# EAGLE design RS9110-N-11-22 Breakout (EAGLE 6.6.0)
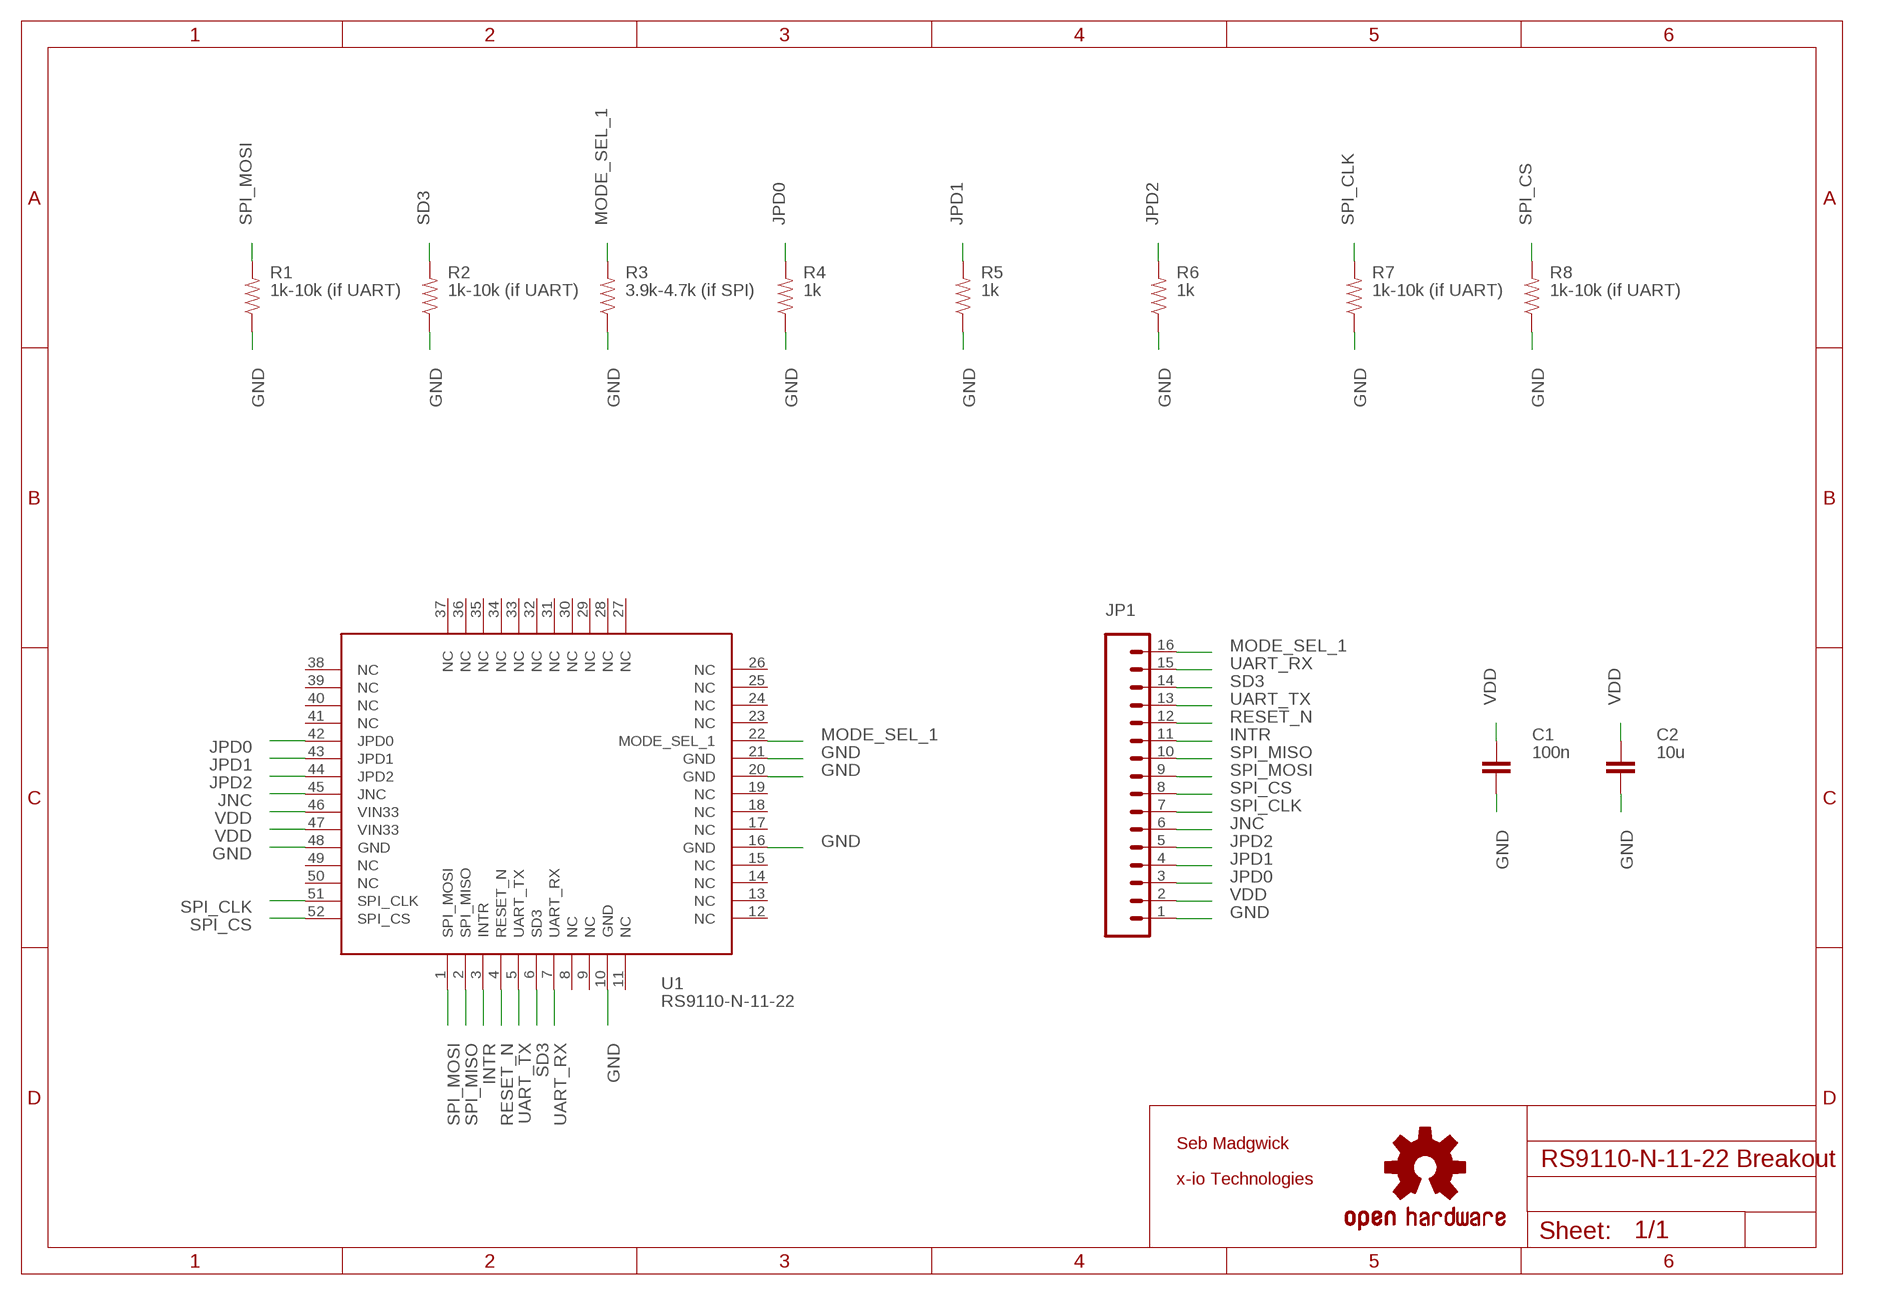
[diagram p0: schematic, sheet 1]

## Parts
C1  100n  CAP0603-CAP  [0603-CAP]
C2  10u  CAP0603-CAP  [0603-CAP]
JP1  M16PTH  [1X16]
LOGO1  OSHW-LOGOS  [OSHW-LOGO-S]
R1  1k-10k (if UART)  RESISTOR0603  [0603-RES]
R2  1k-10k (if UART)  RESISTOR0603  [0603-RES]
R3  3.9k-4.7k (if SPI)  RESISTOR0603  [0603-RES]
R4  1k  RESISTOR0603  [0603-RES]
R5  1k  RESISTOR0603  [0603-RES]
R6  1k  RESISTOR0603  [0603-RES]
R7  1k-10k (if UART)  RESISTOR0603  [0603-RES]
R8  1k-10k (if UART)  RESISTOR0603  [0603-RES]
U1  RS9110-N-11-22  [RS9110-N-11-22]

## Nets
GND: C1.2 C2.2 JP1.1 R1.1 R2.1 R3.1 R4.1 R5.1 R6.1 R7.1 R8.1 U1.10(GND) U1.16(GND) U1.20(GND) U1.21(GND) U1.48(GND)
INTR: JP1.11 U1.3(INTR)
JNC: JP1.6 U1.45(JNC)
JPD0: JP1.3 R4.2 U1.42(JPD0)
JPD1: JP1.4 R5.2 U1.43(JPD1)
JPD2: JP1.5 R6.2 U1.44(JPD2)
MODE_SEL_1: JP1.16 R3.2 U1.22(MODE_SEL_1)
RESET_N: JP1.12 U1.4(RESET_N)
SD3: JP1.14 R2.2 U1.6(SD3)
SPI_CLK: JP1.7 R7.2 U1.51(SPI_CLK)
SPI_CS: JP1.8 R8.2 U1.52(SPI_CS)
SPI_MISO: JP1.10 U1.2(SPI_MISO)
SPI_MOSI: JP1.9 R1.2 U1.1(SPI_MOSI)
UART_RX: JP1.15 U1.7(UART_RX)
UART_TX: JP1.13 U1.5(UART_TX)
VDD: C1.1 C2.1 JP1.2 U1.46(VIN33) U1.47(VIN33)
Unconnected: U1.8(NC) U1.9(NC) U1.11(NC) U1.12(NC) U1.13(NC) U1.14(NC) U1.15(NC) U1.17(NC) U1.18(NC) U1.19(NC) U1.23(NC) U1.24(NC) U1.25(NC) U1.26(NC) U1.27(NC) U1.28(NC) U1.29(NC) U1.30(NC) U1.31(NC) U1.32(NC) U1.33(NC) U1.34(NC) U1.35(NC) U1.36(NC) U1.37(NC) U1.38(NC) U1.39(NC) U1.40(NC) U1.41(NC) U1.49(NC) U1.50(NC)

## Notes on the sheet
- Seb Madgwick
- x-io Technologies

## Library data of the parts
C1 C2 = SparkFun-Capacitors:CAP: Capacitor Standard 0603 ceramic capacitor, and 0.1" leaded capacitor.
JP1 = SparkFun-Connectors:M16: 1x16 .1" header
LOGO1 = SparkFun-Aesthetics:OSHW-LOGO: Open Source Hardware Logo This logo indicates the piece of hardware it is found on incorporates a OSHW license and/or adheres to the definition of open source hardware found here: http://freedomdefined.org/OSHW
R1-R8 = SparkFun-Resistors:RESISTOR: Resistor Basic schematic elements and footprints for 0603, 1206, and PTH resistors.
U1 = x-io:RS9110-N-11-22

## Board
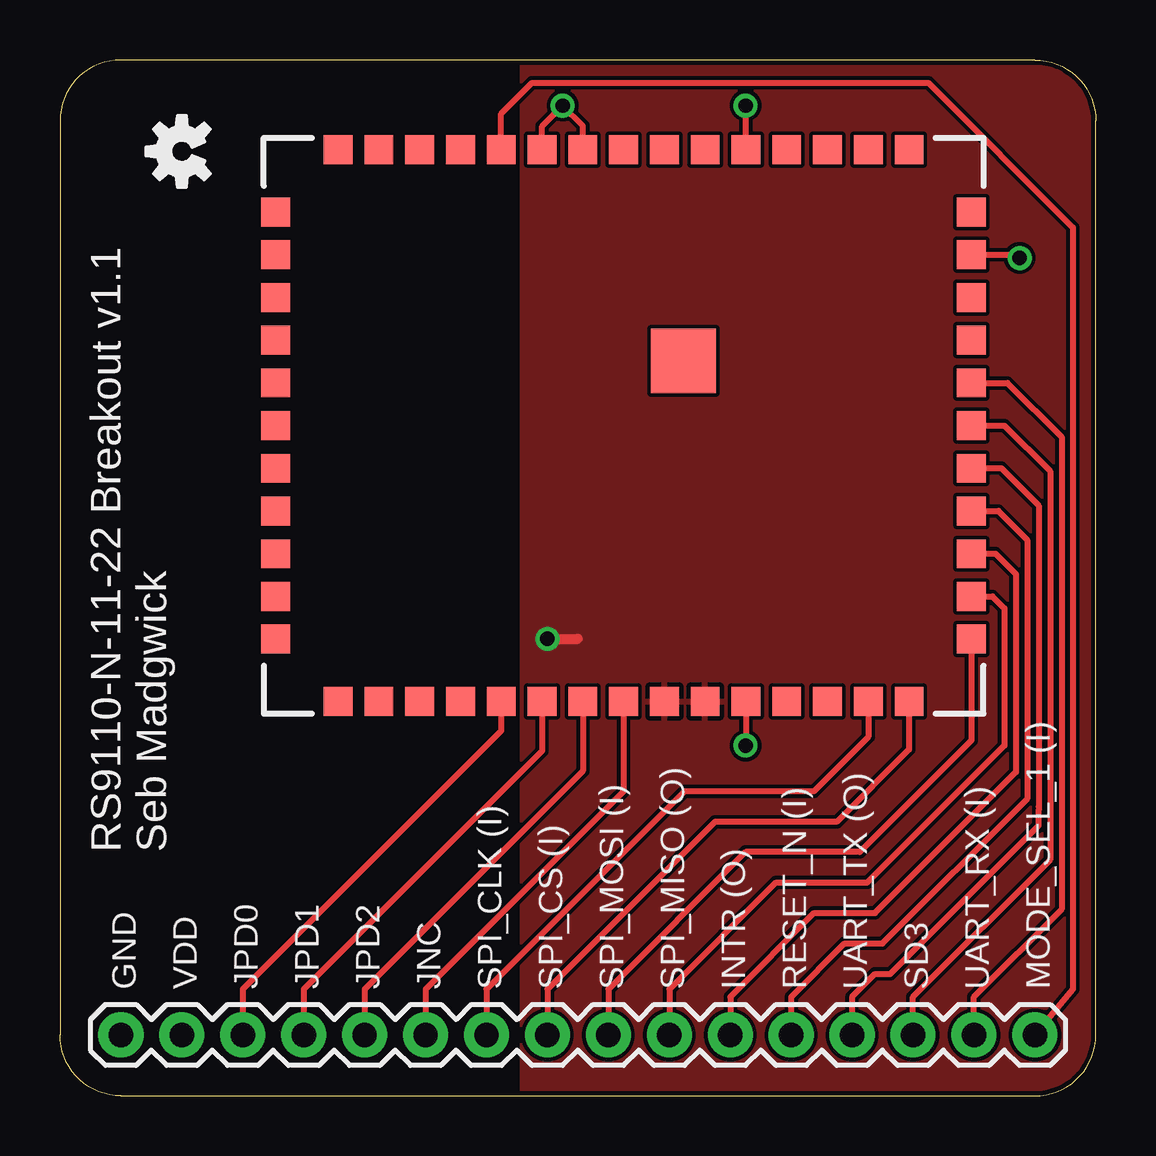
[diagram p1: board, top side]
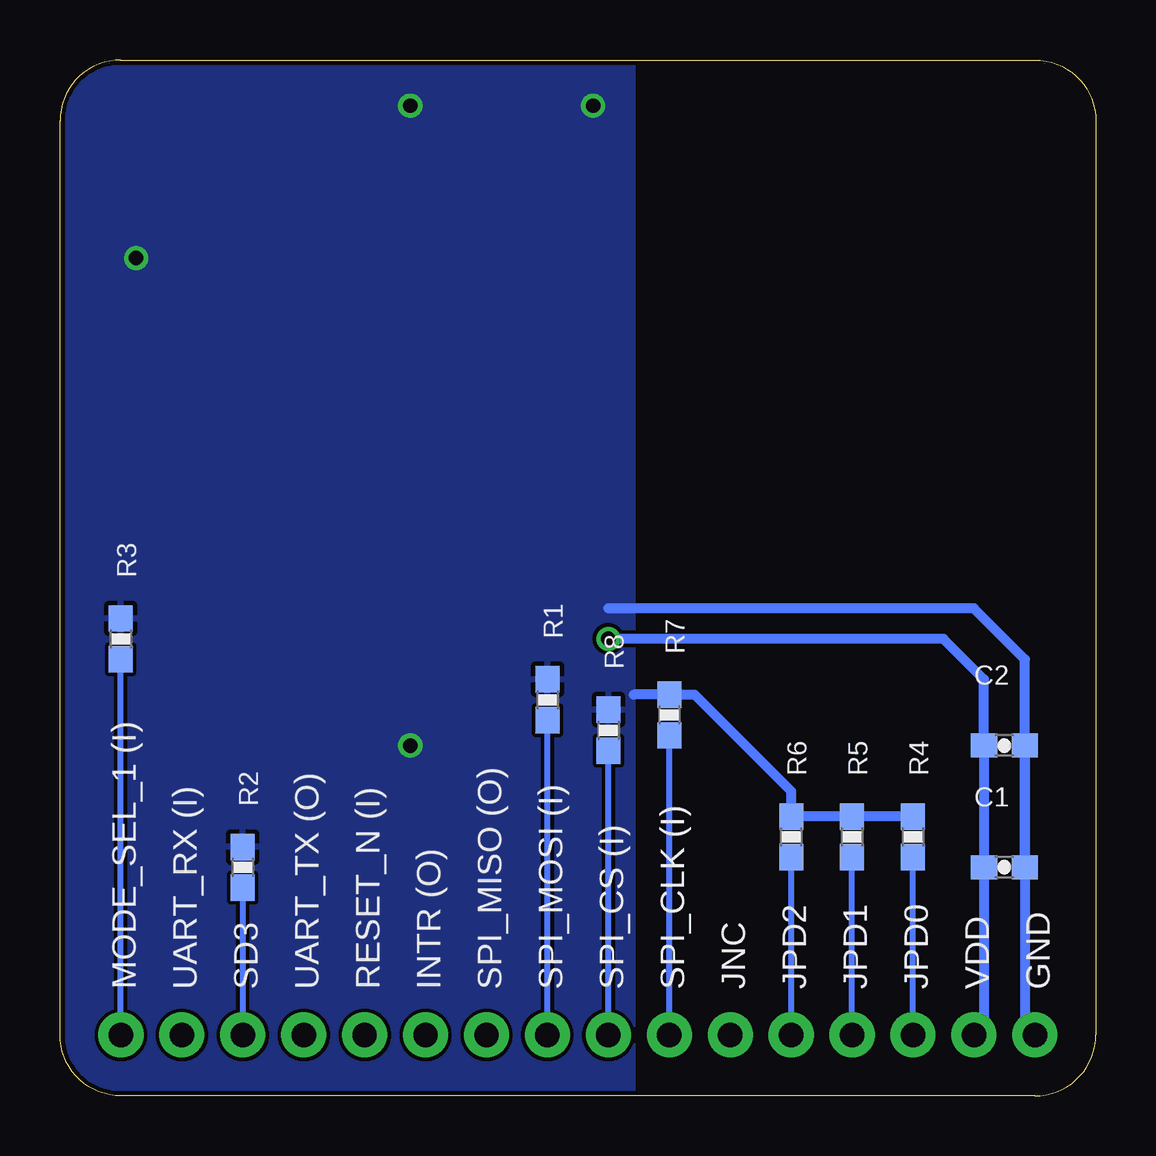
[diagram p2: board, bottom side, seen from below]

Size 43.18 x 43.18 mm. Coordinates in mm from the lower left corner, seen from the top.
Outline: 2.54,0 40.64,0 arc90 43.18,2.54 43.18,40.64 arc90 40.64,43.18 2.54,43.18 arc90 0,40.64 0,2.54 arc90 2.54,0
Copper layers (1*16): Top 0.035mm / dielectric 1.5mm / Bottom 0.035mm
Design rules "default *": minimum track width 6mil, minimum drill 13mil, track to track 6mil, track to pad 6mil, pad to pad 6mil, via to via 6mil, smd to smd 0.15mm, copper to edge 0.2mm, drill to drill 0.15mm, minimum pad ring 10mil, minimum via ring 8mil, stop-mask expansion 4mil, vias tented up to drill 1mm, thermal gap 0.195mm
tRestrict: area 0,0 to 19.1,43.2
bRestrict: area 0,0 to 19.1,43.2

### Footprints (pad centres in the part's own frame; a part is rotated, then mirrored left to right if it is on the bottom)
0603-CAP = smd 1.1 x 1: 1 -0.85,0; 2 0.85,0
1X16 = drill 1.016 pad 1.88: 1 0,0; 2 2.54,0; 3 5.08,0; 4 7.62,0; 5 10.16,0; 6 12.7,0; 7 15.24,0; 8 17.78,0; 9 20.32,0; 10 22.86,0; 11 25.4,0; 12 27.94,0; 13 30.48,0; 14 33.02,0; 15 35.56,0; 16 38.1,0
0603-RES = smd 1.1 x 1: 1 -0.85,0; 2 0.85,0
RS9110-N-11-22 = smd 1.2 x 1.2: 1 -8.9,-14.5; 2 -7.12,-14.5; 3 -5.34,-14.5; 4 -3.56,-14.5; 5 -1.78,-14.5; 6 0,-14.5; 7 1.78,-14.5; 8 3.56,-14.5; 9 5.34,-14.5; 10 7.12,-14.5; 11 8.9,-14.5; 12 11.5,-11.9; 13 11.5,-10.2; 14 11.5,-8.5; 15 11.5,-6.8; 16 11.5,-5.1; 17 11.5,-3.4; 18 11.5,-1.7; 19 11.5,0; 20 11.5,1.7; 21 11.5,3.4; 22 11.5,5.1; 23 11.5,6.8; 24 11.5,8.5; 25 11.5,10.2; 26 11.5,11.9; 27 8.9,14.5; 28 7.12,14.5; 29 5.34,14.5; 30 3.56,14.5; 31 1.78,14.5; 32 0,14.5; 33 -1.78,14.5; 34 -3.56,14.5; 35 -5.34,14.5; 36 -7.12,14.5; 37 -8.9,14.5; 38 -11.5,11.9; 39 -11.5,10.2; 40 -11.5,8.5; 41 -11.5,6.8; 42 -11.5,5.1; 43 -11.5,3.4; 44 -11.5,1.7; 45 -11.5,0; 46 -11.5,-1.7; 47 -11.5,-3.4; 48 -11.5,-5.1; 49 -11.5,-6.8; 50 -11.5,-8.5; 51 -11.5,-10.2; 52 -11.5,-11.9 | smd 2.7 x 2.7: GND 2.7,-2.5

### Placement (x,y rotation side)
C1  3.81,9.53 0 bottom
C2  3.81,14.61 0 bottom
JP1  2.54,2.54 0 top
LOGO1  5.08,39.37 90 top
R1  22.86,16.51 270 bottom
R2  35.56,9.53 270 bottom
R3  40.64,19.05 270 bottom
R4  7.62,10.79 270 bottom
R5  10.16,10.79 270 bottom
R6  12.7,10.79 270 bottom
R7  17.78,15.88 270 bottom
R8  20.32,15.24 270 bottom
U1  23.5,27.94 90 top

### Tracks (layer width: path | path; a pad name or v marks a point on that pad's centre or on a via)
GND  (via drill 0.6)
  Top 0.254: U1.48 28.59,14.62 v28.57,14.61 | U1.21 20.09,40.41 v20.95,41.27 21.8,40.44 U1.20 | U1.16 28.59,41.26 v28.57,41.27 | U1.10 39.87,35.06 v40.01,34.92
  Bottom 0.406: R4.1 R5.1 R6.1 12.7,12.7 16.73,16.73 R7.1 19.27,16.73 | C2.2 C1.2 | C1.2 2.96,2.96 JP1.1 | C1.2 2.96,18.2 5.08,20.32 20.32,20.32
  pour Bottom: 0,43.18 43.18,43.18 43.18,0 0,0
INTR
  Top 0.254: U1.3 38.99,22.6 39.85,21.75 39.85,13.49 33.97,7.62 31.43,7.62 27.94,4.13 JP1.11
JNC
  Top 0.254: U1.45 23.5,12.7 15.24,4.45 JP1.6
JPD0
  Top 0.254: U1.42 18.39,15.22 7.62,4.45 JP1.3
  Bottom 0.254: JP1.3 R4.2
JPD1
  Top 0.254: U1.43 20.09,14.38 10.16,4.45 JP1.4
  Bottom 0.254: JP1.4 R5.2
JPD2
  Top 0.254: U1.44 21.8,13.54 12.7,4.45 JP1.5
  Bottom 0.254: JP1.5 R6.2
MODE_SEL_1
  Top 0.254: U1.22 18.39,40.94 19.68,42.23 36.2,42.23 42.23,36.2 42.23,4.45 JP1.16
  Bottom 0.254: JP1.16 R3.2
RESET_N
  Top 0.254: U1.4 39.12,24.38 40.32,23.18 40.32,12.38 34.29,6.35 32.7,6.35 30.48,4.13 JP1.12
SD3
  Top 0.254: U1.6 39.37,27.94 41.27,26.04 41.27,9.84 35.56,4.13 JP1.14
  Bottom 0.254: R2.2 JP1.14
SPI_CLK
  Top 0.254: U1.51 33.7,14.96 31.43,12.7 26.04,12.7 17.78,4.45 JP1.7
  Bottom 0.254: JP1.7 R7.2
SPI_CS
  Top 0.254: U1.52 35.4,14.44 32.38,11.43 27.3,11.43 20.32,4.45 JP1.8
  Bottom 0.254: JP1.8 R8.2
SPI_MISO
  Top 0.254: U1.2 38.87,20.82 39.37,20.32 39.37,14.61 33.66,8.89 29.84,8.89 25.4,4.45 JP1.10
SPI_MOSI
  Top 0.254: U1.1 37.99,14.82 33.34,10.16 28.57,10.16 22.86,4.45 JP1.9
  Bottom 0.254: JP1.9 R1.2
UART_RX
  Top 0.254: U1.7 39.49,29.72 41.75,27.46 41.75,7.78 38.1,4.13 JP1.15
UART_TX
  Top 0.254: U1.5 39.24,26.16 40.8,24.61 40.8,12.06 40.8,11.91 40.8,11.27 34.61,5.08 33.97,5.08 33.02,4.13 JP1.13
VDD  (via drill 0.6)
  Top 0.406: v20.32,19.05 21.59,19.05
  Bottom 0.406: JP1.2 4.66,2.96 C1.1 C2.1 4.66,17.36 6.35,19.05 v20.32,19.05
  pour Top: 0,43.18 43.18,43.18 43.18,0 0,0

### Text on the board
_tsilk: RS9110-N-11-22 Breakout v1.1 | Seb Madgwick | GND | VDD | JPD0 | JPD1 | JPD2 | JNC | SPI_CLK (I) | SPI_CS (I) | SPI_MOSI (I) | SPI_MISO (O) | INTR (O) | RESET_N (I) | UART_TX (O) | SD3 | UART_RX (I) | MODE_SEL_1 (I)
_bsilk: GND | VDD | JPD0 | JPD1 | JPD2 | JNC | SPI_CLK (I) | SPI_CS (I) | SPI_MOSI (I) | SPI_MISO (O) | INTR (O) | RESET_N (I) | UART_TX (O) | SD3 | UART_RX (I) | MODE_SEL_1 (I)